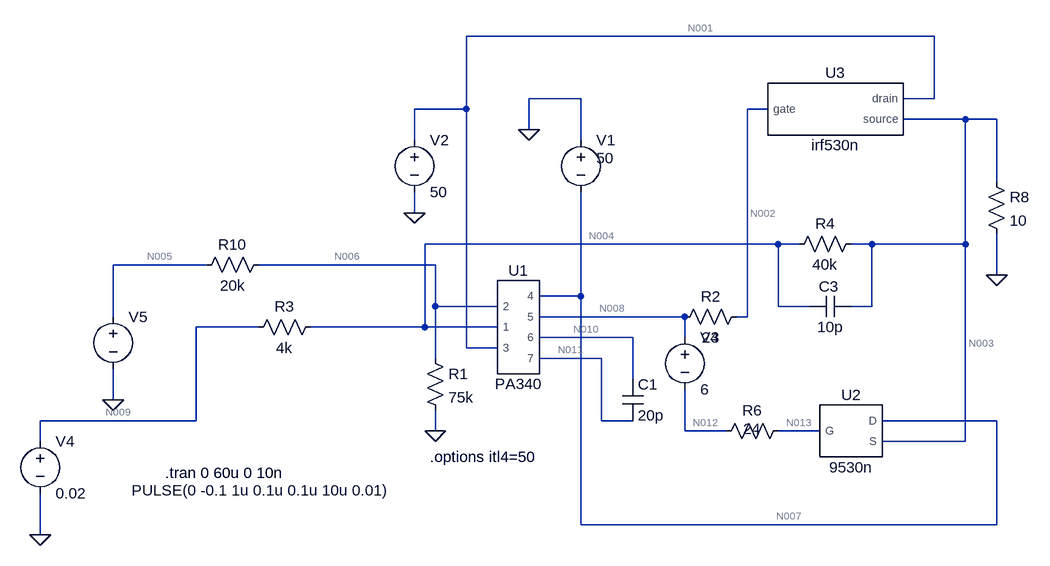
[diagram p0: schematic Draft14.asc]
Draft14.asc, the LTspice schematic file:
Version 4
SHEET 1 1672 680
WIRE 832 -288 112 -288
WIRE 288 -192 208 -192
WIRE 832 -192 832 -288
WIRE 832 -192 784 -192
WIRE 112 -176 112 -288
WIRE 112 -176 32 -176
WIRE 576 -176 544 -176
WIRE 880 -160 784 -160
WIRE 928 -160 880 -160
WIRE 208 -144 208 -192
WIRE 32 -128 32 -176
WIRE 288 -128 288 -192
WIRE 928 -64 928 -160
WIRE 32 -16 32 -48
WIRE 592 32 48 32
WIRE 624 32 592 32
WIRE 736 32 704 32
WIRE 880 32 880 -160
WIRE 880 32 736 32
WIRE -288 64 -432 64
WIRE 64 64 -208 64
WIRE 928 80 928 16
WIRE 288 112 288 -48
WIRE 288 112 224 112
WIRE 64 128 64 64
WIRE 160 128 64 128
WIRE 592 128 592 32
WIRE 640 128 592 128
WIRE 736 128 736 32
WIRE 736 128 704 128
WIRE -432 144 -432 64
WIRE 448 144 224 144
WIRE 544 144 544 -176
WIRE 544 144 528 144
WIRE -208 160 -304 160
WIRE 48 160 48 32
WIRE 48 160 -128 160
WIRE 160 160 48 160
WIRE 368 176 224 176
WIRE 448 176 448 144
WIRE 112 192 112 -176
WIRE 160 192 112 192
WIRE 64 208 64 128
WIRE 320 208 224 208
WIRE 368 240 368 176
WIRE -432 272 -432 224
WIRE -304 304 -304 160
WIRE -304 304 -544 304
WIRE 320 304 320 208
WIRE 368 304 320 304
WIRE 928 304 752 304
WIRE 64 320 64 288
WIRE 448 320 448 256
WIRE 512 320 448 320
WIRE 656 320 592 320
WIRE -544 336 -544 304
WIRE 880 336 880 32
WIRE 880 336 752 336
WIRE 288 464 288 112
WIRE 928 464 928 304
WIRE 928 464 288 464
WIRE -544 480 -544 416
FLAG 32 -16 0
FLAG 208 -144 0
FLAG -544 480 0
FLAG 928 80 0
FLAG -432 272 0
FLAG 64 320 0
SYMBOL PA340 192 160 R0
SYMATTR InstName U1
SYMBOL res 48 192 R0
SYMATTR InstName R1
SYMATTR Value 75k
SYMBOL res 544 128 R90
WINDOW 0 0 56 VBottom 2
WINDOW 3 32 56 VTop 2
SYMATTR InstName R2
SYMATTR Value 24
SYMBOL res -112 144 R90
WINDOW 0 0 56 VBottom 2
WINDOW 3 32 56 VTop 2
SYMATTR InstName R3
SYMATTR Value 4k
SYMBOL cap 352 240 R0
SYMATTR InstName C1
SYMATTR Value 20p
SYMBOL voltage 288 -144 R0
WINDOW 3 24 44 Left 2
WINDOW 123 0 0 Left 0
WINDOW 39 0 0 Left 0
SYMATTR Value 50
SYMATTR InstName V1
SYMBOL voltage 32 -144 R0
WINDOW 123 0 0 Left 0
WINDOW 39 0 0 Left 0
SYMATTR InstName V2
SYMATTR Value 50
SYMBOL res 912 -80 R0
SYMATTR InstName R8
SYMATTR Value 10
SYMBOL res 720 16 R90
WINDOW 0 0 56 VBottom 2
WINDOW 3 32 56 VTop 2
SYMATTR InstName R4
SYMATTR Value 40k
SYMBOL cap 704 112 R90
WINDOW 0 1 34 VBottom 2
WINDOW 3 32 32 VTop 2
SYMATTR InstName C3
SYMATTR Value 10p
SYMBOL res -192 48 R90
WINDOW 0 0 56 VBottom 2
WINDOW 3 32 56 VTop 2
SYMATTR InstName R10
SYMATTR Value 20k
SYMBOL voltage -432 128 R0
WINDOW 123 0 0 Left 0
WINDOW 39 0 0 Left 0
WINDOW 3 29 283 Left 2
SYMATTR Value PULSE(0 -0.1 1u 0.1u 0.1u 10u 0.01)
SYMATTR InstName V5
SYMBOL res 608 304 R90
WINDOW 0 0 56 VBottom 2
WINDOW 3 28 56 VBottom 2
SYMATTR InstName R6
SYMATTR Value 24
SYMBOL voltage 448 160 R0
WINDOW 123 0 0 Left 0
WINDOW 39 0 0 Left 0
SYMATTR InstName V3
SYMATTR Value 6
SYMBOL voltage -544 320 R0
WINDOW 123 0 0 Left 0
WINDOW 39 0 0 Left 0
SYMATTR InstName V4
SYMATTR Value 0.02
SYMBOL irf530n 672 -176 R0
SYMATTR InstName U3
SYMBOL 9530n 704 320 R0
SYMATTR InstName U2
TEXT -352 384 Left 2 !.tran 0 60u 0 10n
TEXT 56 360 Left 2 !.options itl4=50

The netlist it stands for:
* Draft14.asc
XU1 N006 N004 N001 N007 N008 N010 N011 PA340  ; pins 2 1 3 4 5 6 7
R1 N006 0 75k
R2 N002 N008 24
R3 N004 N009 4k
C1 N010 N011 20p
V1 0 N007 50
V2 N001 0 50
R8 N003 0 10
R4 N003 N004 40k
C3 N003 N004 10p
R10 N006 N005 20k
V5 N005 0 PULSE(0 -0.1 1u 0.1u 0.1u 10u 0.01)
R6 N013 N012 24
V3 N008 N012 6
V4 N009 0 0.02
XU3 N001 N002 N003 irf530n  ; pins drain gate source
XU2 N007 N013 N003 9530n  ; pins D G S
.tran 0 60u 0 10n
.options itl4=50
.lib PA340_Pspice.LIB
.lib irf530n.cir
.lib 9530n.cir
.backanno
.end

* Results of the author's LTspice run, read from the files saved beside the schematic
* Operating Point, zero values left out:
*   V(n001) = 50 V
*   V(n007) = -50 V
*   V(n010) = -1.504 mV
*   V(n011) = 1.88 V
*   V(n008) = 1.88 V
*   V(n004) = 12.03 mV
*   V(n006) = -868.4 nV
*   V(n002) = 1.88 V
*   V(n009) = 20 mV
*   V(n003) = -67.72 mV
*   V(n013) = -4.12 V
*   V(n012) = -4.12 V
*   I(R1) = -11.58 pA
*   I(R2) = 48.12 pA
*   I(R3) = -1.994 µA
*   I(R8) = -6.772 mA
*   I(R4) = -1.994 µA
*   I(R10) = -43.42 pA
*   I(R6) = -45.88 pA
*   I(V1) = -8.967 mA
*   I(V2) = -2.193 mA
*   I(V5) = -43.42 pA
*   I(V3) = 45.88 pA
*   I(V4) = -1.994 µA
*   Ix(u1:2) = 55 pA
*   Ix(u1:1) = 50 pA
*   Ix(u1:3) = 2.143 mA
*   Ix(u1:4) = -2.143 mA
*   Ix(u1:5) = 2.233 pA
*   Ix(u3:1) = 50.07 µA
*   Ix(u3:2) = -48.12 pA
*   Ix(u3:3) = -50.07 µA
*   Ix(u2:1) = -6.824 mA
*   Ix(u2:2) = 45.88 pA
*   Ix(u2:3) = 6.824 mA
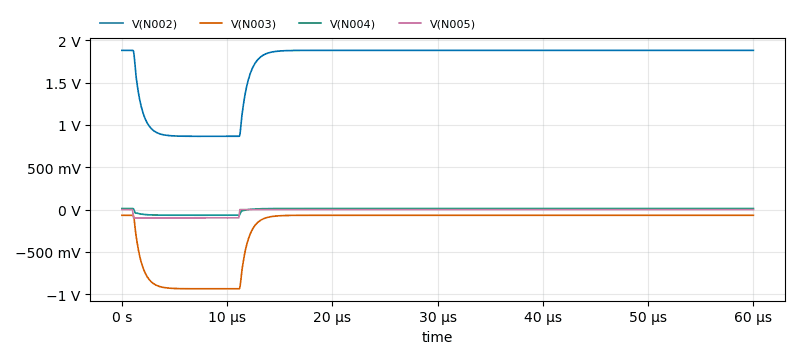
[diagram p1: Transient Analysis of Draft14.asc, plotted from the saved traces]
* Transient Analysis, 1 run:
*   V(N002): min 865.2 mV, max 1.88 V, average 1.708 V, rms 1.747 V, last 1.88 V
*   V(N003): min -936.1 mV, max -67.71 mV, average -213.9 mV, rms 377.1 mV, last -67.72 mV
*   V(N004): min -66.91 mV, max 12.03 mV, average -1.263 mV, rms 28.64 mV, last 12.03 mV
*   V(N005): min -100 mV, max 0 V, average -16.83 mV, rms 40.96 mV, last 0 V